# Altium schematic sheet PasaAltos(HP).SchDoc
size A4
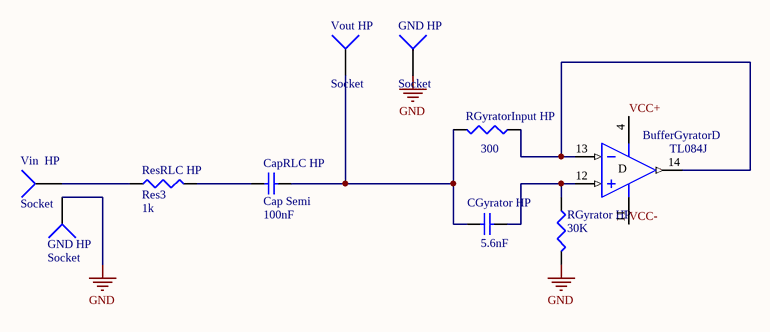
[diagram p0: PasaAltos(HP).SchDoc]

## Parts
(Parts that share a designator on the sheet are numbered #1, #2 ... from top to bottom, then left to right.)
BufferGyrator  TL084J  [J014]  (part D of 4)
CapRLC_HP  Cap Semi  value 100nF  [C0805]
CGyrator_HP  value 5.6nF  [C0805]  (hidden comment: Cap Semi)
GND_HP#1  Socket  [PIN1]
GND_HP#2  Socket  [PIN1]
ResRLC_HP  Res3  value 1k  [6-0805_M]
RGyrator_HP  value 30K  [6-0805_M]  (hidden comment: Res3)
RGyratorInput_HP  value 300  [6-0805_M]  (hidden comment: Res3)
Vin_HP  Socket  [PIN1]
Vout_HP  Socket  [PIN1]

## Nets
GND: GND_HP#1.1 GND_HP#2.1 RGyrator_HP.2
VCC+: BufferGyrator.4(V+)
VCC-: BufferGyrator.11(V-)
NetBufferGyrator_12: BufferGyrator.12(IN+) CGyrator_HP.1 RGyrator_HP.1
NetBufferGyrator_13: BufferGyrator.13(IN-) BufferGyrator.14(OUT) RGyratorInput_HP.1
NetCapRLC_HP_1: CapRLC_HP.1 CGyrator_HP.2 RGyratorInput_HP.2 Vout_HP.1
NetCapRLC_HP_2: CapRLC_HP.2 ResRLC_HP.2
NetResRLC_HP_1: ResRLC_HP.1 Vin_HP.1

## Notes on the sheet
- (in symbol TL084J, part D) D

## Library data of the parts
BufferGyrator = TL084J: JFET-Input Operational Amplifier; Published: 16-Jan-2001; LatestRevisionDate: 04-Mar-2005; LatestRevisionNote: Stylized 3D Model Added.; DatasheetVersion: Feb-1999; PackageVersion: Jun-1999; PackageReference: J014; Publisher: Altium Limited; PackageDescription: DIP; 14 Leads; Row Spacing 7.62 mm; Pitch 2.54 mm; ComponentLink1Description: Manufacturer Link; ComponentLink1URL: http://www.ti.com/; ComponentLink2Description: Datasheet; ComponentLink2URL: http://www-s.ti.com/sc/ds/tl084.pdf
CapRLC_HP CGyrator_HP = Cap Semi: Capacitor (Semiconductor SIM Model); Published: 8-Jun-2000; LatestRevisionDate: 29-May-2009; LatestRevisionNote: IPC-7351 Footprint Added.; PackageReference: C1206; Publisher: Altium Limited; PackageDescription: Chip Capacitor
ResRLC_HP RGyrator_HP RGyratorInput_HP = Res3: Resistor; Published: 8-Jun-2000; LatestRevisionDate: 29-May-2009; LatestRevisionNote: IPC-7351 Footprint Added.; PackageReference: J1-0603; Publisher: Altium Limited; PackageDescription: Chip Resistor
GND_HP#1 GND_HP#2 Vin_HP Vout_HP = Socket: LatestRevisionDate: 17-Jul-2002; LatestRevisionNote: Re-released for DXP Platform.; Publisher: Altium Limited